# EAGLE design mitutoyo-spc-interface (EAGLE 5.11)
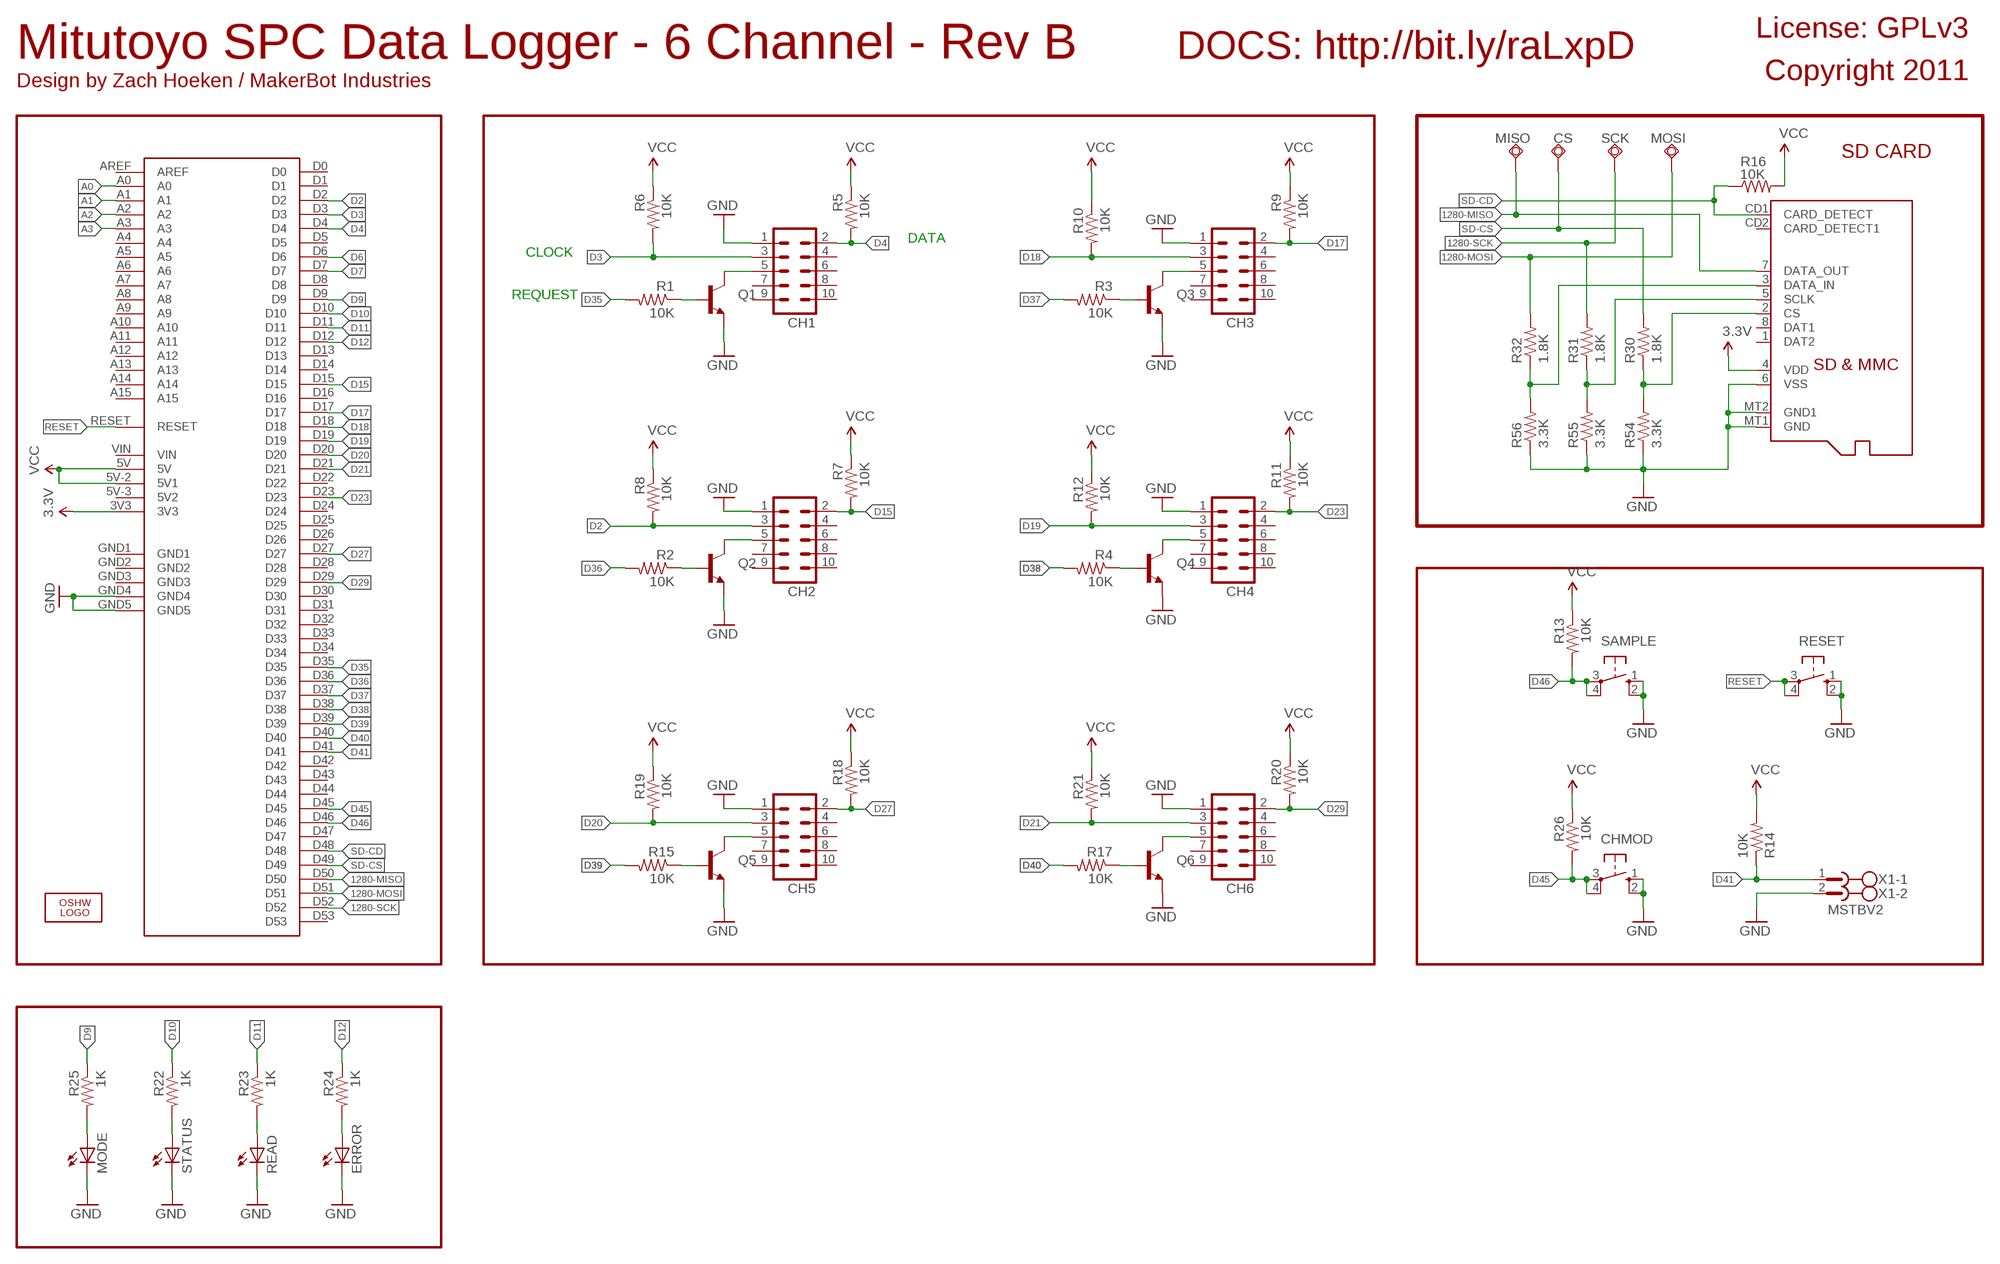
[diagram p0: schematic, sheet 1]

## Parts
CH1  ML10  [ML10]
CH2  ML10  [ML10]
CH3  ML10  [ML10]
CH4  ML10  [ML10]
CH5  ML10  [ML10]
CH6  ML10  [ML10]
CHMOD  10-XX  [B3F-10XX]
CS  TPSQTP09R  [TP09R]
ERROR  LED1206  [LED-1206]
LOGO2  OSHW_LOGO_10MILX0200-NT  [OSHW_10X200_NOTEXT]
MISO  TPSQTP09R  [TP09R]
MODE  LED1206  [LED-1206]
MOSI  TPSQTP09R  [TP09R]
MP1  DNP  MICROSD  [MICROSD]
Q1  TRANSISTOR_NPNTO92  [TO-92]
Q2  TRANSISTOR_NPNTO92  [TO-92]
Q3  TRANSISTOR_NPNTO92  [TO-92]
Q4  TRANSISTOR_NPNTO92  [TO-92]
Q5  TRANSISTOR_NPNTO92  [TO-92]
Q6  TRANSISTOR_NPNTO92  [TO-92]
R1  10K  RESISTOR  [0805]
R2  10K  RESISTOR  [0805]
R3  10K  RESISTOR  [0805]
R4  10K  RESISTOR  [0805]
R5  10K  RESISTOR  [0805]
R6  10K  RESISTOR  [0805]
R7  10K  RESISTOR  [0805]
R8  10K  RESISTOR  [0805]
R9  10K  RESISTOR  [0805]
R10  10K  RESISTOR  [0805]
R11  10K  RESISTOR  [0805]
R12  10K  RESISTOR  [0805]
R13  10K  RESISTOR  [0805]
R14  10K  RESISTOR  [0805]
R15  10K  RESISTOR  [0805]
R16  10K  RESISTOR  [0805]
R17  10K  RESISTOR  [0805]
R18  10K  RESISTOR  [0805]
R19  10K  RESISTOR  [0805]
R20  10K  RESISTOR  [0805]
R21  10K  RESISTOR  [0805]
R22  1K  RESISTOR  [0805]
R23  1K  RESISTOR  [0805]
R24  1K  RESISTOR  [0805]
R25  1K  RESISTOR  [0805]
R26  10K  RESISTOR  [0805]
R30  1.8K  RESISTOR  [0805]
R31  1.8K  RESISTOR  [0805]
R32  1.8K  RESISTOR  [0805]
R54  3.3K  RESISTOR  [0805]
R55  3.3K  RESISTOR  [0805]
R56  3.3K  RESISTOR  [0805]
READ  LED1206  [LED-1206]
RESET  10-XX  [B3F-10XX]
SAMPLE  10-XX  [B3F-10XX]
SCK  TPSQTP09R  [TP09R]
STATUS  LED1206  [LED-1206]
U$1  ARDUINO-MEGA  [ARDUINO-MEGA]
X1  MSTBV2  [MSTBV2]

## Nets
3.3V [3.3V]: MP1.4(VDD) U$1.3V3
1280-MISO: MISO.TP MP1.7(DATA_OUT) U$1.D50
1280-MOSI: MOSI.TP R32.2 U$1.D51
1280-SCK: R31.2 SCK.TP U$1.D52
A0: U$1.A0
A1: U$1.A1
A2: U$1.A2
A3: U$1.A3
D2: CH2.3 R8.2 U$1.D2
D3: CH1.3 R6.2 U$1.D3
D4: CH1.2 R5.2 U$1.D4
D6: U$1.D6
D7: U$1.D7
D9: R25.1 U$1.D9
D10: R22.1 U$1.D10
D11: R23.1 U$1.D11
D12: R24.1 U$1.D12
D15: CH2.2 R7.2 U$1.D15
D17: CH3.2 R9.2 U$1.D17
D18: CH3.3 R10.2 U$1.D18
D19: CH4.3 R12.2 U$1.D19
D20: CH5.3 R19.2 U$1.D20
D21: CH6.3 R21.2 U$1.D21
D23: CH4.2 R11.2 U$1.D23
D27: CH5.2 R18.2 U$1.D27
D29: CH6.2 R20.2 U$1.D29
D35: R1.2 U$1.D35
D36: R2.2 U$1.D36
D37: R3.2 U$1.D37
D38: R4.2 U$1.D38
D39: R15.2 U$1.D39
D40: R17.2 U$1.D40
D41: R14.1 U$1.D41 X1.1
D45: CHMOD.3(P) CHMOD.4(P1) R26.2 U$1.D45
D46: R13.2 SAMPLE.3(P) SAMPLE.4(P1) U$1.D46
GND [gnd]: CH1.1 CH2.1 CH3.1 CH4.1 CH5.1 CH6.1 CHMOD.1(S) CHMOD.2(S1) ERROR.C MODE.C MP1.6(VSS) MP1.MT1(GND) MP1.MT2(GND1) Q1.1(E) Q2.1(E) Q3.1(E) Q4.1(E) Q5.1(E) Q6.1(E) R54.1 R55.1 R56.1 READ.C RESET.1(S) RESET.2(S1) SAMPLE.1(S) SAMPLE.2(S1) STATUS.C U$1.GND4 U$1.GND5 X1.2
N$1: Q5.2(B) R15.1
N$2: CH1.5 Q1.3(C)
N$3: CH3.5 Q3.3(C)
N$4: CH4.5 Q4.3(C)
N$5: CH2.5 Q2.3(C)
N$6: Q6.2(B) R17.1
N$7: CH6.5 Q6.3(C)
N$8: CH5.5 Q5.3(C)
N$9: Q1.2(B) R1.1
N$10: R22.2 STATUS.A
N$11: Q2.2(B) R2.1
N$12: R23.2 READ.A
N$13: ERROR.A R24.2
N$14: Q3.2(B) R3.1
N$15: MODE.A R25.2
N$17: Q4.2(B) R4.1
N$219: MP1.2(CS) R30.1 R54.2
N$223: MP1.3(DATA_IN) R32.1 R56.2
N$224: MP1.5(SCLK) R31.1 R55.2
RESET: RESET.3(P) RESET.4(P1) U$1.RESET
SD-CD: MP1.CD1(CARD_DETECT) R16.1 U$1.D48
SD-CS: CS.TP R30.2 U$1.D49
VCC: R5.1 R6.1 R7.1 R8.1 R9.1 R10.1 R11.1 R12.1 R13.1 R14.2 R16.2 R18.1 R19.1 R20.1 R21.1 R26.1 U$1.5V U$1.5V-2(5V1)
Unconnected: CH1.4 CH1.6 CH1.7 CH1.8 CH1.9 CH1.10 CH2.4 CH2.6 CH2.7 CH2.8 CH2.9 CH2.10 CH3.4 CH3.6 CH3.7 CH3.8 CH3.9 CH3.10 CH4.4 CH4.6 CH4.7 CH4.8 CH4.9 CH4.10 CH5.4 CH5.6 CH5.7 CH5.8 CH5.9 CH5.10 CH6.4 CH6.6 CH6.7 CH6.8 CH6.9 CH6.10 MP1.1(DAT2) MP1.8(DAT1) MP1.CD2(CARD_DETECT1) U$1.5V-3(5V2) U$1.A4 U$1.A5 U$1.A6 U$1.A7 U$1.A8 U$1.A9 U$1.A10 U$1.A11 U$1.A12 U$1.A13 U$1.A14 U$1.A15 U$1.AREF U$1.D0 U$1.D1 U$1.D5 U$1.D8 U$1.D13 U$1.D14 U$1.D16 U$1.D22 U$1.D24 U$1.D25 U$1.D26 U$1.D28 U$1.D30 U$1.D31 U$1.D32 U$1.D33 U$1.D34 U$1.D42 U$1.D43 U$1.D44 U$1.D47 U$1.D53 U$1.GND1 U$1.GND2 U$1.GND3 U$1.VIN

## Notes on the sheet
- License: GPLv3
- Mitutoyo SPC Data Logger - 6 Channel - Rev B | DOCS: http://bit.ly/raLxpD | Copyright 2011
- Design by Zach Hoeken / MakerBot Industries
- SD CARD
- DATA
- CLOCK
- REQUEST

## Library data of the parts
CH1-CH6 = con-ml:ML10: HARTING
CHMOD RESET SAMPLE = switch-omron:10-XX: OMRON SWITCH
CS MISO MOSI SCK = testpad:TPSQ: Test pad
ERROR MODE READ STATUS = SparkFun:LED: LEDs Standard schematic elements and footprints for 5mm, 3mm, 1206, and 0603 sized LEDs. 5mm - Spark Fun Electronics SKU : COM-00529 (and others)
LOGO2 = OSHW:OSHW_LOGO_10MIL
MP1 = adafruit:MICROSD: Micro-SD / Transflash card holder with SPI pinout For the 3M # 2908-05WB-MG and/or 4UCON #19656 push-push type
Q1-Q6 = SparkFun:TRANSISTOR_NPN: Transistor NPN BJT configuration in SOT23 package. MMBT2222 is the common NPN we use. Double check BCE configuration again layout.
R1-R26 R30-R32 R54-R56 = SparkFun:RESISTOR: Resistor Basic schematic elements and footprints for 0603, 1206, and PTH 1/10th watt (small) resistors.
U$1 = MakerBot:ARDUINO-MEGA
X1 = con-phoenix-508:MSTBV2: PHOENIX; MPN: MSTBV 2,5/2-GF-5.08; OC_FARNELL: 1792792; OC_NEWARK: 69R9845

## Net classes
0 default: width 0.254 mm, drill 0.508 mm, clearance 0.254 mm
2 gnd: width 0.254 mm, drill 0.508 mm, clearance 0.254 mm
3 5V: width 0.254 mm, drill 0.508 mm, clearance 0.254 mm
4 3.3V: width 0.254 mm, drill 0.508 mm, clearance 0.254 mm

## Board
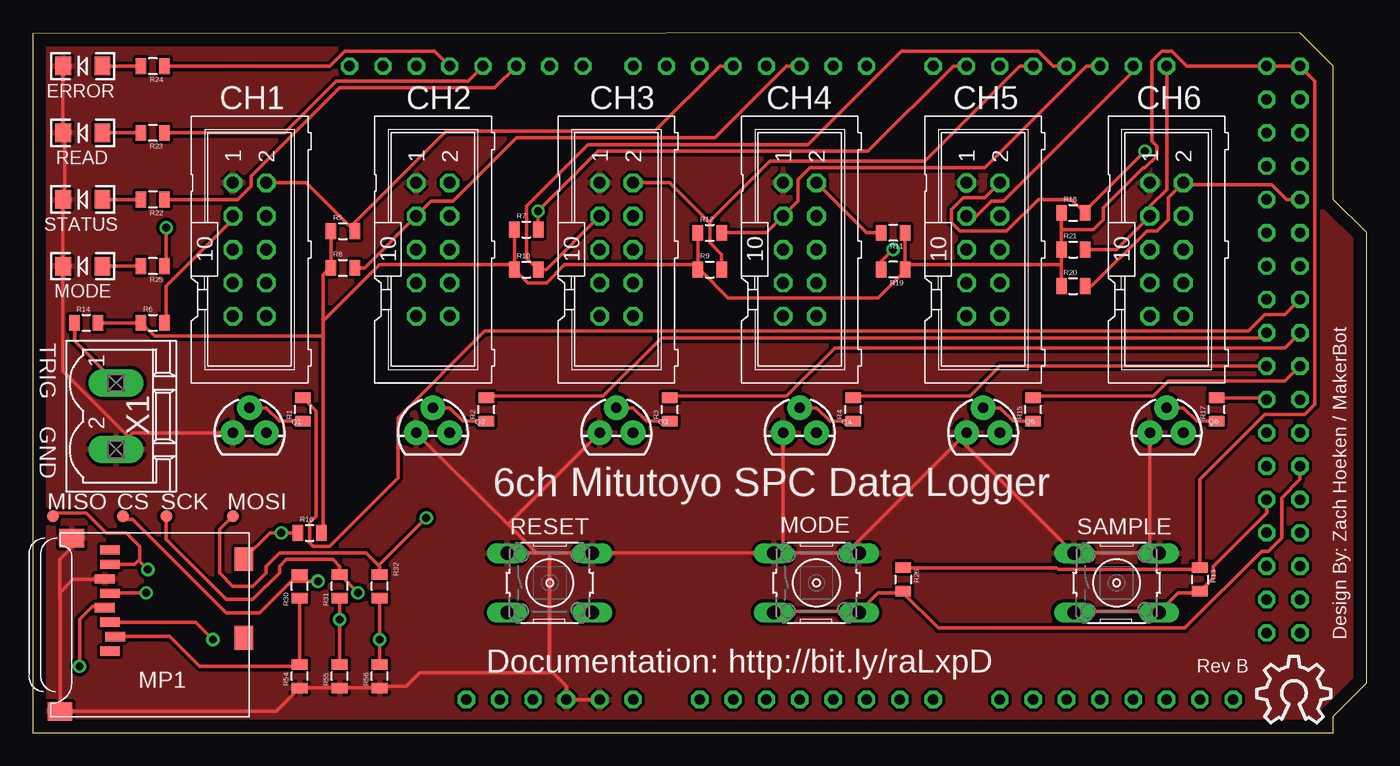
[diagram p1: board, top side]
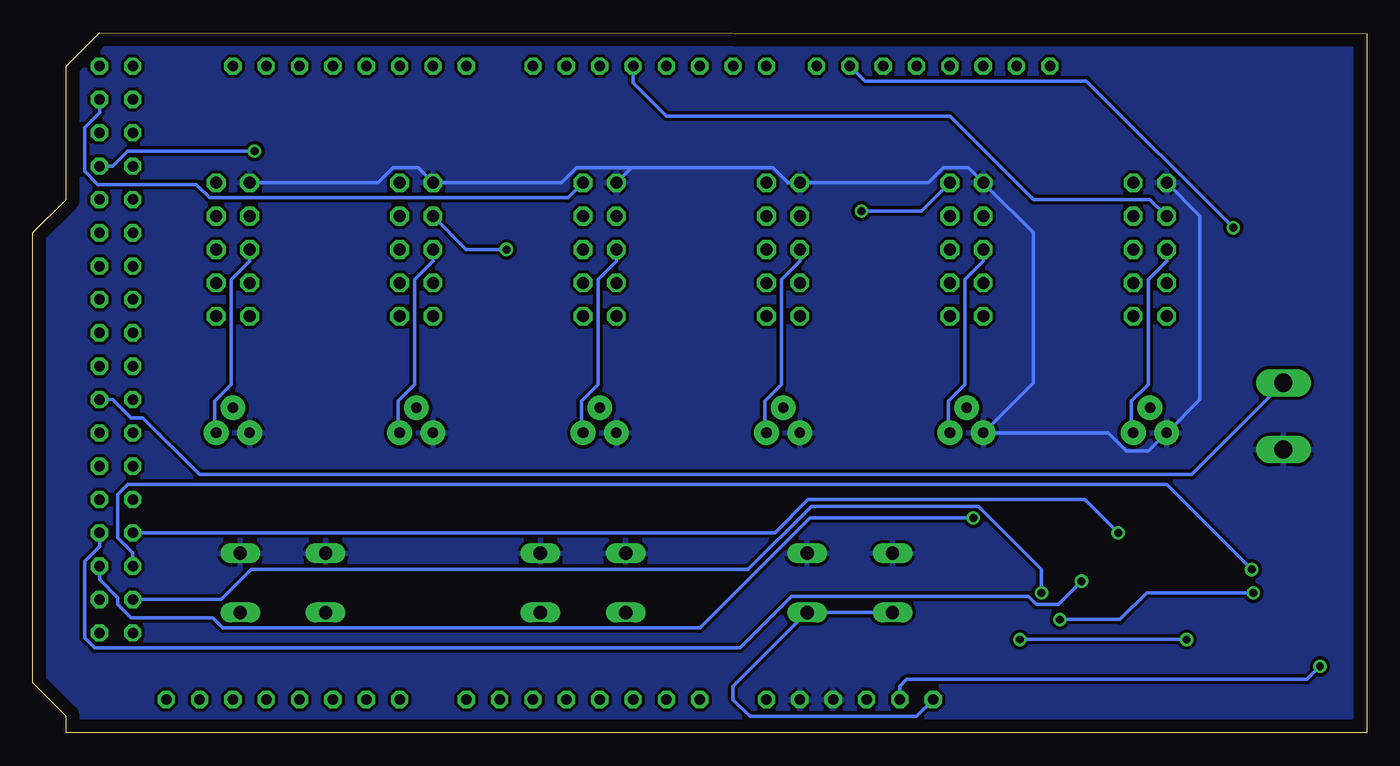
[diagram p2: board, bottom side, seen from below]

Size 101.6 x 53.34 mm. Coordinates in mm from the lower left corner, seen from the top.
Outline: 0,0 99.06,0 99.06,1.27 101.6,3.81 101.6,38.1 99.06,40.64 99.06,50.8 96.52,53.34 0,53.26 0,0
Copper layers (1*16): Top 0.035mm / dielectric 1.5mm / Bottom 0.035mm
Design rules "default": minimum track width 10mil, minimum drill 24mil, track to track 8mil, track to pad 8mil, pad to pad 8mil, via to via 8mil, smd to smd 8mil, copper to edge 40mil, drill to drill 8mil, minimum pad ring 10mil, minimum via ring 8mil, stop-mask expansion 4mil, vias tented up to drill 0mil, thermal gap 10mil

### Footprints (pad centres in the part's own frame; a part is rotated, then mirrored left to right if it is on the bottom)
ML10 = drill 0.914 octagon: 1 -5.08,-1.27; 2 -5.08,1.27; 3 -2.54,-1.27; 4 -2.54,1.27; 5 0,-1.27; 6 0,1.27; 7 2.54,-1.27; 8 2.54,1.27; 9 5.08,-1.27; 10 5.08,1.27
B3F-10XX = drill 1.016 long: 1 -3.251,2.261; 2 3.251,2.261; 3 -3.251,-2.261; 4 3.251,-2.261
TP09R = smd 0.9 x 0.9: TP 0,0
LED-1206 = smd 1.2 x 1.4: A -1.5,0; C 1.5,0
MICROSD = smd 0.7 x 1.5: 1 9,-10.64; 2 7.9,-10.24; 3 6.8,-10.64; 4 5.7,-11.04; 5 4.6,-10.64; 6 3.5,-11.04; 7 2.4,-10.64; 8 1.3,-10.64 | smd 1.8 x 1.4: CD1 2,-0.44; CD2 8,-0.44 | smd 1.4 x 1.9: MT1 0.4,-13.54; MT2 13.6,-14.44
TO-92 = drill 0.813 pad 1.88 round: 1 -1.27,0; 2 0,1.905; 3 1.27,0
0805 = smd 0.8 x 1.2: 1 -0.9,0; 2 0.9,0
ARDUINO-MEGA = drill 0.8 octagon: 3V3 35.56,2.54; 5V 93.98,50.8; 5V-2 96.52,50.8; 5V-3 38.1,2.54; A0 50.8,2.54; A1 53.34,2.54; A2 55.88,2.54; A3 58.42,2.54; A4 60.96,2.54; A5 63.5,2.54; A6 66.04,2.54; A7 68.58,2.54; A8 73.66,2.54; A9 76.2,2.54; A10 78.74,2.54; A11 81.28,2.54; A12 83.82,2.54; A13 86.36,2.54; A14 88.9,2.54; A15 91.44,2.54; AREF 24.13,50.8; D0 63.5,50.8; D1 60.96,50.8; D2 58.42,50.8; D3 55.88,50.8; D4 53.34,50.8; D5 50.8,50.8; D6 48.26,50.8; D7 45.72,50.8; D8 41.91,50.8; D9 39.37,50.8; D10 36.83,50.8; D11 34.29,50.8; D12 31.75,50.8; D13 29.21,50.8; D14 68.58,50.8; D15 71.12,50.8; D16 73.66,50.8; D17 76.2,50.8; D18 78.74,50.8; D19 81.28,50.8; D20 83.82,50.8; D21 86.36,50.8; D22 93.98,48.26; D23 96.52,48.26; D24 93.98,45.72; D25 96.52,45.72; D26 93.98,43.18; D27 96.52,43.18; D28 93.98,40.64; D29 96.52,40.64; D30 93.98,38.1; D31 96.52,38.1; D32 93.98,35.56; D33 96.52,35.56; D34 93.98,33.02; D35 96.52,33.02; D36 93.98,30.48; D37 96.52,30.48; D38 93.98,27.94; D39 96.52,27.94; D40 93.98,25.4; D41 96.52,25.4; D42 93.98,22.86; D43 96.52,22.86; D44 93.98,20.32; D45 96.52,20.32; D46 93.98,17.78; D47 96.52,17.78; D48 93.98,15.24; D49 96.52,15.24; D50 93.98,12.7; D51 96.52,12.7; D52 93.98,10.16; D53 96.52,10.16; GND1 26.67,50.8; GND2 93.98,7.62; GND3 96.52,7.62; GND4 40.64,2.54; GND5 43.18,2.54; RESET 33.02,2.54; VIN 45.72,2.54
MSTBV2 = drill 1.397 long: 1 -2.54,0; 2 2.54,0

### Placement (x,y rotation side)
CH1  16.51,36.83 270 top
CH2  30.48,36.83 270 top
CH3  44.45,36.83 270 top
CH4  58.42,36.83 270 top
CH5  72.39,36.83 270 top
CH6  86.36,36.83 270 top
CHMOD  59.69,11.43 0 top
CS  6.86,16.51 0 top
ERROR  3.81,50.8 180 top
LOGO2  93.22,0.76 0 top
MISO  1.52,16.51 0 top
MODE  3.81,35.56 180 top
MOSI  15.24,16.51 0 top
MP1  16.51,15.24 270 top
Q1  16.51,22.86 0 top
Q2  30.48,22.86 0 top
Q3  44.45,22.86 0 top
Q4  58.42,22.86 0 top
Q5  72.39,22.86 0 top
Q6  86.36,22.86 0 top
R1  20.57,24.64 90 top
R2  34.54,24.64 90 top
R3  48.51,24.64 90 top
R4  62.48,24.64 90 top
R5  23.62,38.23 0 top
R6  9.14,31.24 0 top
R7  37.59,38.35 0 top
R8  23.62,35.43 0 top
R9  51.56,35.31 0 top
R10  37.59,35.31 0 top
R11  65.53,38.1 180 top
R12  51.56,38.1 0 top
R13  88.9,11.68 270 top
R14  4.06,31.24 0 top
R15  76.2,24.64 90 top
R16  21.08,15.24 0 top
R17  90.17,24.64 90 top
R18  79.25,39.62 0 top
R19  65.53,35.31 180 top
R20  79.25,34.04 0 top
R21  79.25,36.83 0 top
R22  9.14,40.64 180 top
R23  9.14,45.72 180 top
R24  9.14,50.8 180 top
R25  9.14,35.56 180 top
R26  66.29,11.68 270 top
R30  20.32,11.18 90 top
R31  23.37,11.18 90 top
R32  26.42,11.18 90 top
R54  20.32,4.32 90 top
R55  23.37,4.32 90 top
R56  26.42,4.32 90 top
READ  3.81,45.72 180 top
RESET  39.37,11.43 0 top
SAMPLE  82.55,11.43 0 top
SCK  10.16,16.51 0 top
STATUS  3.81,40.64 180 top
U$1  0,0 0 top
X1  6.35,24.13 270 top

### Tracks (layer width: path | path; a pad name or v marks a point on that pad's centre or on a via)
3.3V  (via drill 0.6)
  Top 0.254: v3.56,5.08 3.56,8.64 4.57,9.65 5.36,9.65 MP1.4
  Bottom 0.254: U$1.3V3 35.56,3.56 35.05,4.06 4.57,4.06 v3.56,5.08
1280-MISO  (via drill 0.61)
  Top 0.254: MP1.7 7.76,12.84 8.06,13.14 | 8.06,13.14 8.13,13.21 8.13,14.22 7.11,15.24 5.59,15.24 4.06,16.76 1.52,16.76 MISO.TP | 8.06,13.14 v8.76,12.45
  Bottom 0.254: U$1.D50 93.98,13.72 95.12,14.86 95.12,18.16 94.36,18.92 15.24,18.92 v8.76,12.45
1280-MOSI  (via drill 0.61)
  Top 0.254: R32.2 26.42,12.7 26.35,12.76 | 26.35,12.76 25.4,13.72 18.8,13.72 17.78,12.7 17.78,12.19 16.76,11.18 15.24,11.18 14.22,12.19 14.22,15.49 MOSI.TP | 26.35,12.76 v29.97,16.38
  Bottom 0.254: U$1.D51 96.52,11.68 95.12,10.29 95.12,9.78 94.11,8.76 87.88,8.76 87.12,8 50.8,8 42.42,16.38 v29.97,16.38
1280-SCK  (via drill 0.61)
  Top 0.254: SCK.TP 10.16,14.73 14.73,10.16 16.76,10.16 18.8,12.19 18.8,12.7 19.3,13.21 22.86,13.21 23.37,12.7 R31.2 23.37,12.06 v24.77,10.67
  Bottom 0.254: U$1.D52 87.25,10.16 84.96,12.45 47.12,12.45 42.29,17.27 29.59,17.27 24.77,12.45 v24.77,10.67
D2
  Top 0.254: R8.2 25.27,35.43 CH2.3 30.35,40.51 32,40.51 36.83,45.34 51.94,45.34 57.4,50.8 U$1.D2
D3
  Top 0.254: CH1.3 15.24,39.12 10.16,34.04 10.16,31.24 R6.2
  Bottom 0.254: CH1.3 16.51,40.64 25.4,40.64 31.75,46.99 53.34,46.99 55.88,49.53 U$1.D3
D4
  Top 0.254: CH1.2 20.83,41.91 R5.2 24.26,38.61 31.5,45.85 47.37,45.85 52.32,50.8 U$1.D4
D9  (via drill 0.61)
  Top 0.254: v10.16,38.48 10.16,35.56 R25.1
  Bottom 0.254: v10.16,38.48 21.34,49.66 38.23,49.66 U$1.D9
D10
  Top 0.254: U$1.D10 35.18,49.15 23.37,49.15 16.64,42.42 16.64,41.66 15.62,40.64 R22.1
D11
  Top 0.254: U$1.D11 33.15,49.66 23.11,49.66 19.18,45.72 R23.1
D12
  Top 0.254: U$1.D12 30.61,51.94 23.75,51.94 22.61,50.8 R24.1
D15  (via drill 0.61)
  Top 0.254: R7.2 v38.48,39.75 43.05,44.32 63.63,44.32 70.1,50.8 U$1.D15
  Bottom 0.254: v38.48,39.75 33.91,39.75 CH2.2
D17
  Top 0.254: 51.5,38.92 48.51,41.91 CH3.2 | 51.5,38.92 51.56,38.86 51.56,37.34 52.45,36.45 R9.2 | U$1.D17 75.18,50.8 67.94,43.56 56.13,43.56 51.5,38.92
D18
  Top 0.254: CH3.3 39.12,35.31 R10.2 37.59,36.2 37.59,40.13 42.29,44.83 59.05,44.83 66.17,51.94 76.58,51.94 77.72,50.8 U$1.D18
D19
  Top 0.254: R12.2 55.88,38.1 CH4.3 58.29,40.51 58.29,42.16 59.18,43.05 72.52,43.05 80.26,50.8 U$1.D19
D20  (via drill 0.61)
  Top 0.254: v65.53,36.83 64.64,35.94 64.64,35.31 R19.2 | U$1.D20 83.82,50.42 73.91,40.51 73.03,40.51 71.88,39.37 CH5.3
  Bottom 0.254: v65.53,36.83 68.58,36.83 CH5.3
D21
  Top 0.254: R21.2 82.55,36.83 CH6.3 85.09,40.13 86.36,41.4 U$1.D21
D23
  Top 0.254: CH4.2 63.5,38.1 R11.2
  Bottom 0.254: U$1.D23 96.52,47.24 97.66,46.1 97.66,42.8 96.65,41.78 89.15,41.78 88.14,40.77 60.83,40.77 CH4.2
D27  (via drill 0.61)
  Top 0.254: CH5.2 72.52,40.77 70.87,40.77 69.98,39.88 69.98,38.86 70.61,38.23 74.17,38.23 76.58,40.64 79.12,40.64 80.14,39.62 R18.2 80.14,39.75 v84.71,44.32
  Bottom 0.254: U$1.D27 95.5,43.18 94.36,44.32 v84.71,44.32
D29
  Top 0.254: R20.2 80.64,34.04 84.84,38.23 85.6,38.23 86.49,39.12 86.49,40.77 CH6.2 87.63,41.78 94.36,41.78 95.5,40.64 U$1.D29
D35
  Top 0.254: U$1.D35 95.38,31.88 93.85,31.88 92.58,30.61 34.42,30.61 27.81,24 27.81,19.43 22.61,14.22 21.34,14.22 21.08,14.48 21.08,16 21.59,16.51 21.59,24.51 20.57,25.53 R1.2
D36
  Top 0.254: U$1.D36 93.6,30.1 47.88,30.1 43.43,25.65 34.54,25.65 R2.2
D37
  Top 0.254: U$1.D37 95.38,29.34 61.09,29.34 57.4,25.65 48.51,25.65 R3.2
D38
  Top 0.254: U$1.D38 73.66,27.94 71.37,25.65 62.48,25.65 R4.2
D39
  Top 0.254: U$1.D39 95.38,26.8 86.49,26.8 85.34,25.65 76.2,25.65 R15.2
D40
  Top 0.254: U$1.D40 93.85,25.53 90.17,25.53 R17.2
D41
  Top 0.254: X1.1 3.17,29.84 3.17,31.24 R14.1
  Bottom 0.254: U$1.D41 95.5,25.4 94.11,24 93.22,24 88.9,19.68 13.34,19.68 X1.1
D45
  Top 0.254: 66.29,10.67 64.39,10.67 62.99,9.27 CHMOD.4 62.87,9.27 56.52,9.27 CHMOD.3 | U$1.D45 96.52,19.3 95.12,17.91 95.12,14.86 94.11,13.84 93.6,13.84 87.76,8 68.96,8 66.29,10.67 | 66.29,10.67 R26.2
D46
  Top 0.254: U$1.D46 93.98,16.76 89.92,12.7 89.92,11.81 88.9,10.79 R13.2 88.9,10.67 87.25,10.67 85.85,9.27 SAMPLE.4 85.72,9.27 79.38,9.27 SAMPLE.3
GND
  Top 0.254: 39.37,4.57 29.46,4.57 28.45,3.56 26.55,3.56 R56.1 R55.1 R54.1 18.54,1.64 MP1.MT2 2.07,10.16 | 39.37,4.57 39.62,4.57 40.64,3.56 U$1.GND4 U$1.GND5 | 2.07,10.16 2.07,10.71 3.05,11.68 5.41,11.68 MP1.6 | MP1.MT1 2.97,14.15 2.03,13.21 2.03,10.2 2.07,10.16 | 39.37,13.72 42.55,13.72 RESET.2 42.67,13.72 56.39,13.72 CHMOD.1 | 39.37,13.72 38.35,13.72 | 38.35,13.72 36.2,13.72 RESET.1 | 38.35,13.72 36.2,15.88 | 36.2,15.88 Q2.1 | 36.2,15.88 Q3.1 | 39.37,4.57 39.37,13.72 | 85.09,13.72 85.72,13.72 SAMPLE.2 85.09,13.72 | 85.09,13.72 79.38,13.72 SAMPLE.1 79.25,13.72 70.61,22.35 | 85.09,13.72 Q6.1 | 61.98,13.72 62.87,13.72 CHMOD.2 61.98,13.72 | 57.15,13.72 61.98,13.72 | 57.15,13.72 56.52,13.72 CHMOD.1 | 57.15,13.72 Q4.1 | CHMOD.1 57.15,13.72 | 61.98,13.72 70.61,22.35 | 70.61,22.35 Q5.1 | Q1.1 7.62,22.86 X1.2 7.24,22.61 2.29,27.56 2.29,35.56 | ERROR.C 2.29,50.8 2.29,45.72 READ.C 2.41,45.72 2.41,40.77 STATUS.C | 2.29,35.56 2.29,40.64 STATUS.C | STATUS.C 2.41,40.64 | 2.29,35.56 MODE.C
  Bottom 0.254: 56.07,42.99 CH4.1 | 56.07,42.99 56.01,43.05 45.21,43.05 44.07,41.91 CH3.1 33.4,41.91 32.26,43.05 30.35,43.05 CH2.1 | 56.07,42.99 56.13,43.05 60.2,43.05 61.34,41.91 CH5.1 72.26,43.05 74.17,43.05 75.31,41.91 CH6.1 | 28.96,41.91 28.96,41.66 25.4,38.1 25.4,26.67 Q2.1 19.68,22.86 18.29,21.46 16.64,21.46 Q1.1 12.7,25.4 12.7,39.37 CH1.1
  pour Bottom: 0,0 101.6,0 101.6,53.34 0,53.34
  pour Top: 0,0 101.6,0 101.6,53.34 0,53.34
N$1
  Top 0.254: Q5.2 73.66,24.77 74.68,23.75 R15.1
N$2
  Bottom 0.254: CH1.5 15.24,35.94 16.64,34.54 16.64,26.54 17.91,25.27 17.91,22.99 Q1.3
N$3
  Bottom 0.254: CH3.5 43.18,35.94 44.58,34.54 44.58,26.54 45.85,25.27 45.85,22.99 Q3.3
N$4
  Bottom 0.254: CH4.5 57.15,35.94 58.55,34.54 58.55,26.54 59.82,25.27 59.82,22.99 Q4.3
N$5
  Bottom 0.254: CH2.5 29.21,35.94 30.61,34.54 30.61,26.54 31.88,25.27 31.88,22.99 Q2.3
N$6
  Top 0.254: Q6.2 87.63,24.77 88.65,23.75 R17.1
N$7
  Bottom 0.254: CH6.5 85.09,35.94 86.49,34.54 86.49,26.54 87.76,25.27 87.76,22.99 Q6.3
N$8
  Bottom 0.254: CH5.5 71.12,35.94 72.52,34.54 72.52,26.54 73.79,25.27 73.79,22.99 Q5.3
N$9
  Top 0.254: Q1.2 17.78,24.77 18.8,23.75 R1.1
N$10
  Top 0.254: STATUS.A R22.2
N$11
  Top 0.254: Q2.2 31.75,24.77 32.77,23.75 R2.1
N$12
  Top 0.254: READ.A R23.2
N$13
  Top 0.254: ERROR.A R24.2
N$14
  Top 0.254: Q3.2 45.72,24.77 46.74,23.75 R3.1
N$15
  Top 0.254: MODE.A R25.2
N$17
  Top 0.254: Q4.2 59.69,24.77 60.71,23.75 R4.1
N$219
  Top 0.254: R30.1 R54.2 20.18,5.08 12.7,5.08 10.44,7.34 MP1.2
N$223  (via drill 0.6)
  Top 0.254: MP1.3 12.39,8.44 v13.72,7.11 | R56.2 v26.42,7.11 R32.1
  Bottom 0.254: v13.72,7.11 v26.42,7.11
N$224  (via drill 0.6)
  Top 0.254: R31.1 v23.37,8.64 R55.2 | v8.64,10.67 5.9,10.67 MP1.5
  Bottom 0.254: v23.37,8.64 18.8,8.64 16.76,10.67 v8.64,10.67
RESET
  Bottom 0.254: U$1.RESET 34.29,1.27 46.99,1.27 48.26,2.54 48.26,3.53 RESET.4 RESET.3
SD-CD  (via drill 0.61)
  Top 0.254: R16.1 v18.92,15.24 18.07,15.24 MP1.CD1
  Bottom 0.254: U$1.D48 45.09,15.24 42.55,17.78 21.46,17.78 v18.92,15.24
SD-CS  (via drill 0.61)
  Top 0.254: R30.2 20.2,12.08 19.75,11.62 | 19.75,11.62 17.27,9.14 14.73,9.14 7.62,16.26 6.6,16.26 CS.TP | v21.72,11.56 19.81,11.56 19.75,11.62
  Bottom 0.254: U$1.D49 96.52,14.22 97.66,13.08 97.66,7.24 96.9,6.48 47.75,6.48 43.81,10.41 25.78,10.41 25.15,9.78 23.5,9.78 v21.72,11.56
VCC
  Top 0.254: 50.67,35.69 50.67,38.1 R12.1 | 50.67,35.69 50.67,35.31 R9.1 | 36.7,35.69 36.7,38.35 R7.1 | 36.7,35.69 36.7,35.31 | 50.67,35.69 40.51,35.69 39.12,34.29 37.72,34.29 36.7,35.31 | 50.67,35.69 R9.1 | 36.7,35.31 R10.1 36.7,35.69 | R14.2 R6.1 8.26,31.24 9.27,30.23 22.1,30.23 | 22.1,31.37 22.1,34.92 22.61,35.43 R8.1 22.73,35.43 22.73,38.23 R5.1 | 22.1,30.23 22.1,31.37 | 22.1,30.23 22.1,15.24 R16.2 | 36.7,35.69 26.42,35.69 22.1,31.37 | R26.1 77.98,12.57 78.11,12.45 88.77,12.45 R13.1 88.9,19.3 93.85,24.26 96.9,24.26 97.66,25.02 97.66,49.66 U$1.5V-2 U$1.5V 87.88,50.8 86.74,51.94 85.98,51.94 85.22,51.18 85.22,45.09 85.6,44.7 85.6,43.94 84.71,43.05 84.58,43.05 81.53,40.01 81.53,39.12 80.77,38.35 78.36,38.35 | 66.42,35.69 R11.1 | 66.42,35.69 R19.1 | 78.36,35.69 R21.1 | 78.36,35.69 R20.1 | R21.1 78.36,38.35 | 78.36,38.35 R18.1 | R21.1 | 66.42,35.69 78.36,35.69 | R19.1 66.42,35.69 | R9.1 50.67,35.18 50.93,35.18 52.96,33.15 64.39,33.15 66.42,35.18 R19.1

### Text on the board
tPlace: TRIG | GND | 6ch Mitutoyo SPC Data Logger | MODE | Design By: Zach Hoeken / MakerBot | Documentation: http://bit.ly/raLxpD | Rev B